# Altium project Stream_Deck.PrjPcb
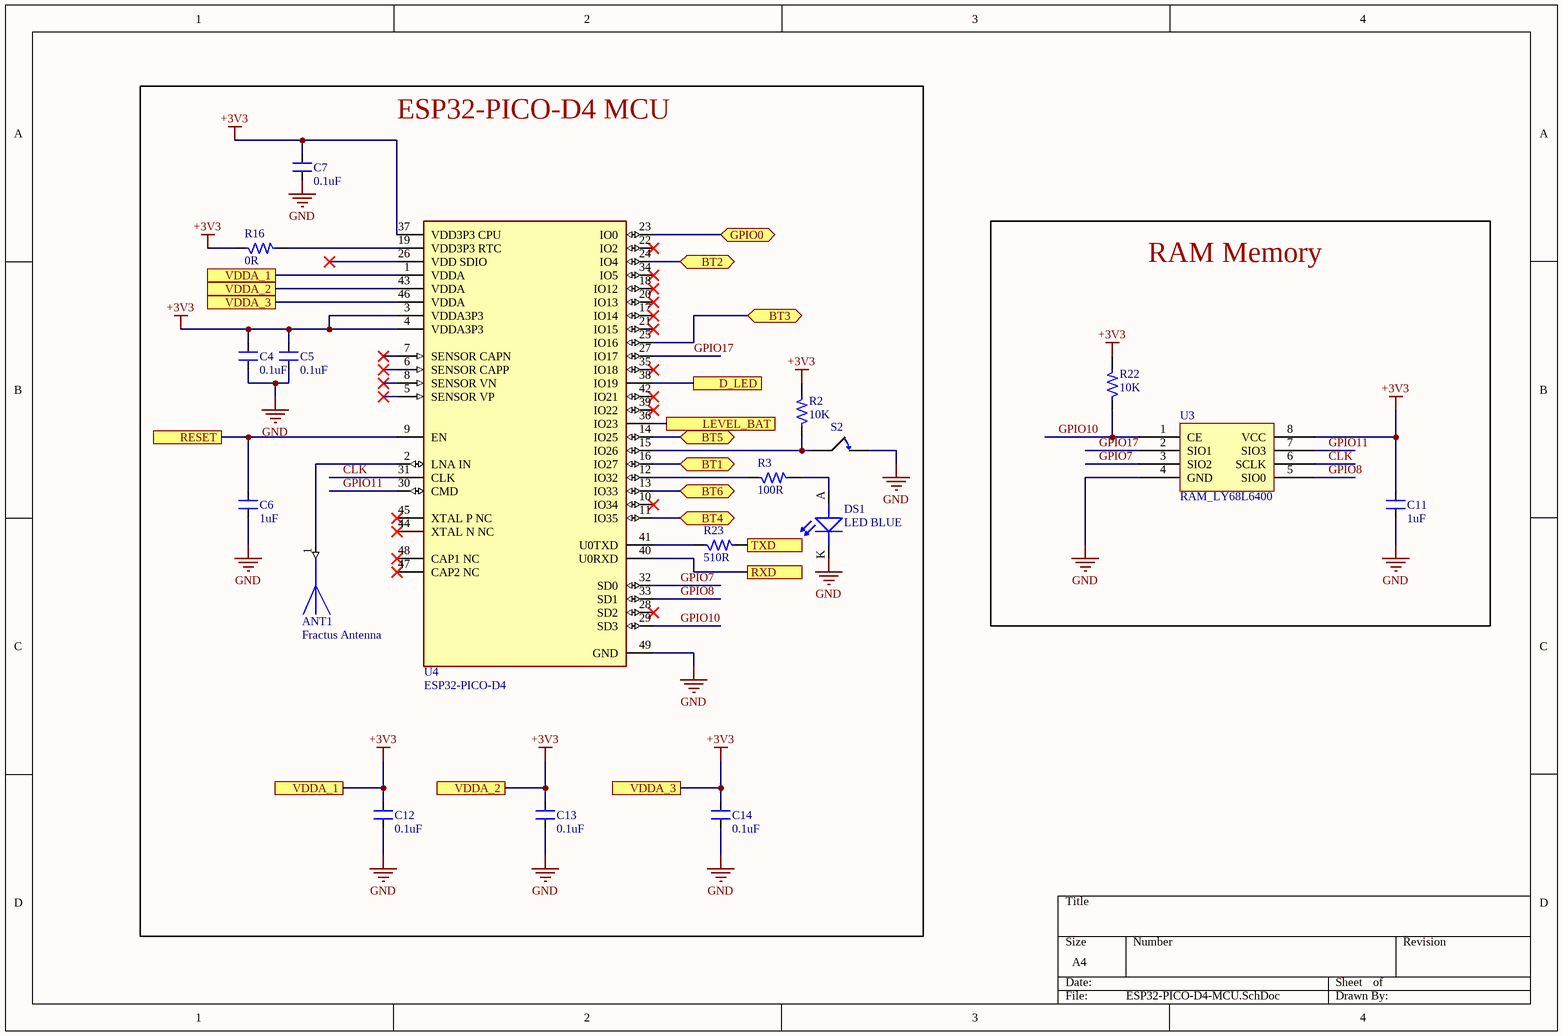
[diagram p0: ESP32-PICO-D4-MCU.SchDoc]
6 sheets, 80 parts. Net scope: flat (ports and power ports of the same name join across sheets).
Board file: main.PcbDoc
Sheets:
  ESP32-PICO-D4-MCU.SchDoc
  POWER-BATTERY.SchDoc
  RESET-SWITCHES.SchDoc
  SERIAL-CHIP.SchDoc
  Block-Diagram.SchDoc
  POWER-BUDGET.SchDoc

## Sheet ESP32-PICO-D4-MCU.SchDoc
size A4; SheetNumber: 1; SheetTotal: 6

### Parts
ANT1  Fractus Antenna  [Fractus_Antenna_NN01-102]
C4  0.1uF  [CAP_0805]
C5  0.1uF  [CAP_0805]
C6  1uF  [CAP_0805]
C7  0.1uF  [CAP_0805]
C11  1uF  [CAP_0805]
C12  0.1uF  [CAP_0805]
C13  0.1uF  [CAP_0805]
C14  0.1uF  [CAP_0805]
DS1  LED BLUE  [LED_0805]
R2  10K  [RES_0805]
R3  100R  [RES_0805]
R16  0R  [RES_0805]
R22  10K  [RES_0805]
R23  510R  [RES_0805]
S2  Button Tactile Switch, NO 0.05 A 0.8mm  [Button8014X17N]  (value not drawn)
U3  RAM_LY68L6400  [RAM_LY68L6400]
U4  ESP32-PICO-D4  [Espressif_Systems_0_IPC_A]

### Blocks framed on the sheet
ESP32-PICO-D4 MCU: ANT1 C4-C7 C12-C14 DS1 R2 R3 R16 R23 S2 U4
RAM Memory: C11 R22 U3

### Ports
BT1 (bidir), BT2 (bidir), BT3 (bidir), BT4 (bidir), BT5 (bidir), BT6 (bidir), D_LED, GPIO0 (bidir), LEVEL_BAT, RESET, RXD, TXD, VDDA_1, VDDA_2, VDDA_3

### Nets
+3V3: C4.2 C5.2 C7.2 C11.2 C12.2 C13.2 C14.2 R2.2 R16.1 R22.2 U3.8(VCC) U4.1(VDDA) U4.3(VDDA3P3) U4.4(VDDA3P3) U4.37(VDD3P3_CPU) U4.43(VDDA) U4.46(VDDA) ; port VDDA_1, port VDDA_2, port VDDA_3
GND: C4.1 C5.1 C6.1 C7.1 C11.1 C12.1 C13.1 C14.1 DS1.K(CATHODE) S2.2 U3.4(GND) U4.49(GND)
BT1: U4.16(IO27) ; port BT1
BT2: U4.24(IO4) ; port BT2
BT3: U4.25(IO16) ; port BT3
BT4: U4.11(IO35) ; port BT4
BT5: U4.14(IO25) ; port BT5
BT6: U4.13(IO33) ; port BT6
CLK: U3.6(SCLK) U4.31(CLK)
D_LED: U4.38(IO19) ; port D_LED
GPIO0: U4.23(IO0) ; port GPIO0
GPIO7: U3.3(SIO2) U4.32(SD0)
GPIO8: U3.5(SIO0) U4.33(SD1)
GPIO10: R22.1 U3.1(CE) U4.29(SD3)
GPIO11: U3.7(SIO3) U4.30(CMD)
GPIO17: U3.2(SIO1) U4.27(IO17)
LEVEL_BAT: U4.36(IO23) ; port LEVEL_BAT
RESET: C6.2 U4.9(EN) ; port RESET
RXD: U4.40(U0RXD) ; port RXD
TXD: R23.2 ; port TXD
NetANT1_1: ANT1.1 U4.2(LNA_IN)
NetDS1_A: DS1.A(ANODE) R3.2
NetR2_1: R2.1 S2.1 U4.15(IO26)
NetR3_1: R3.1 U4.12(IO32)
NetR16_2: R16.2 U4.19(VDD3P3_RTC)
NetR23_1: R23.1 U4.41(U0TXD)

Not connected (* = marked no-connect by the designer): U4 5(SENSOR_VP)* 6(SENSOR_CAPP)* 7(SENSOR_CAPN)* 8(SENSOR_VN)* 10(IO34)* 17(IO14)* 18(IO12)* 20(IO13)* 21(IO15)* 22(IO2)* 26(VDD_SDIO)* 28(SD2)* 34(IO5)* 35(IO18)* 39(IO22)* 42(IO21)* 44(XTAL_N_NC)* 45(XTAL_P_NC)* 47(CAP2_NC)* 48(CAP1_NC)*

### Library data of the parts
ANT1 = ANT_2.45GHz_Bluetooth_WLAN_Zigbee_1.7dBi_NN01-102: 2.45GHz Bluetooth, WLAN, Zigbe Chip RF Antenna 2.4GHz ~ 2.5GHz 1.7dBi Solder Surface Mount
C4 C5 C7 C12-C14 = CAP_0.1uF-50V-10%-0805: 0.1µF ±10% 50V Ceramic Capacitor X7R 0805 (2012 Metric); Manufacturer: Samsung; Manufacturer Part Number: CL21B104KBCNNNC; Alternate Part Number-1: NA; Case/Package: 0805; Supplier-1: SIRICOM; Supplier Part Number-1: 0805B104K500CT
C6 C11 = CAP_1uF-50V-10%-0805_1: 1µF ±10% 50V Ceramic Capacitor X7R 0805 (2012 Metric); Manufacturer: Samsung; Manufacturer Part Number: CL21B104KBCNNNC; Alternate Part Number-1: NA; Case/Package: 0805; Supplier-1: SIRICOM; Supplier Part Number-1: 0805B104K500CT
DS1 = LED_BLUE-3V3-20mA-0805: Blue 470nm LED Indication - Discrete 3.3V 0805 (2012 Metric); Manufacturer: Vishay Lite-On; Manufacturer Part Number: LTST-C171TBKT; Alternate Part Number-1: NA; Case/Package: 0805; Supplier-1: SP ROAD; Supplier Part Number-1: LTST-C171TBKT
R2 R22 = RES_10K-0.125W-1%-0805: 10 kOhms ±1% 0.125W, 1/8W Chip Resistor 0805 (2012 Metric) Automotive AEC-Q200 Thick Film; Manufacturer: CTS; Manufacturer Part Number: WR08X1002FTL; Case/Package: 0805; Supplier-1: SIRICOM; Supplier Part Number-1: WR08X1002FTL; Alternate Part Number-1: WR08X1002FTL
R3 = RES_100R-0.125W-1%-0805: 100 Ohms ±1% 0.125W, 1/8W Chip Resistor 0805 (2012 Metric) Automotive AEC-Q200, Pulse Withstanding Thick Film; Manufacturer: Walsin; Manufacturer Part Number: WR08X1000FTL; Case/Package: 0805; Supplier-1: SIRICOM; Supplier Part Number-1: WR08X1000FTL; Alternate Part Number-1: WR08X1000FTL
R16 = RES_0R-0.125W-1%-0805: 0 Ohms Jumper 0.125W, 1/8W Chip Resistor 0805 (2012 Metric) Automotive AEC-Q200 Thick Film; Manufacturer: Walsin; Manufacturer Part Number: WR08X000PTL; Case/Package: 0805; Supplier-1: SIRICOM; Supplier Part Number-1: WR08X000PTL; Alternate Part Number-1: WR08X000PTL
R23 = RES_510R-0.125W-1%-0805: 510 Ohms ±1% 0.125W, 1/8W Chip Resistor 0805 (2012 Metric) Thin Film; Manufacturer: Yageo; Manufacturer Part Number: RT0805FRE07510RL; Alternate Part Number-1: NA; Case/Package: 0805; Supplier-1: SIRICOM; Supplier Part Number-1: WR08X5100FTL
S2 = Button Tactile Switch, NO 0.05 A 0.8mm: Manufacturer: C & K; Manufacturer Part No.: B3F1000; State: Normaly Open; Date Created: 25 February 2015; Creator: R Kanjee; RS Stock No.: 516-255

## Sheet POWER-BATTERY.SchDoc
size A4; SPICEModelCacheDLZXOQBQ: <root> / <DocumentId>DLZXOQBQ</DocumentId> / <CacheFrame Number="0"> / <Model Name="skydiode" Kind="MDL"> / <Text>*Default Schottky Diode / *Schottky Diode Pinout: A,K / .MODEL SKYDIODE D(EG=0.69 XTI=2)</Text> / </Model> / </CacheFrame> / </root>; SheetNumber: 3; SheetTotal: 7
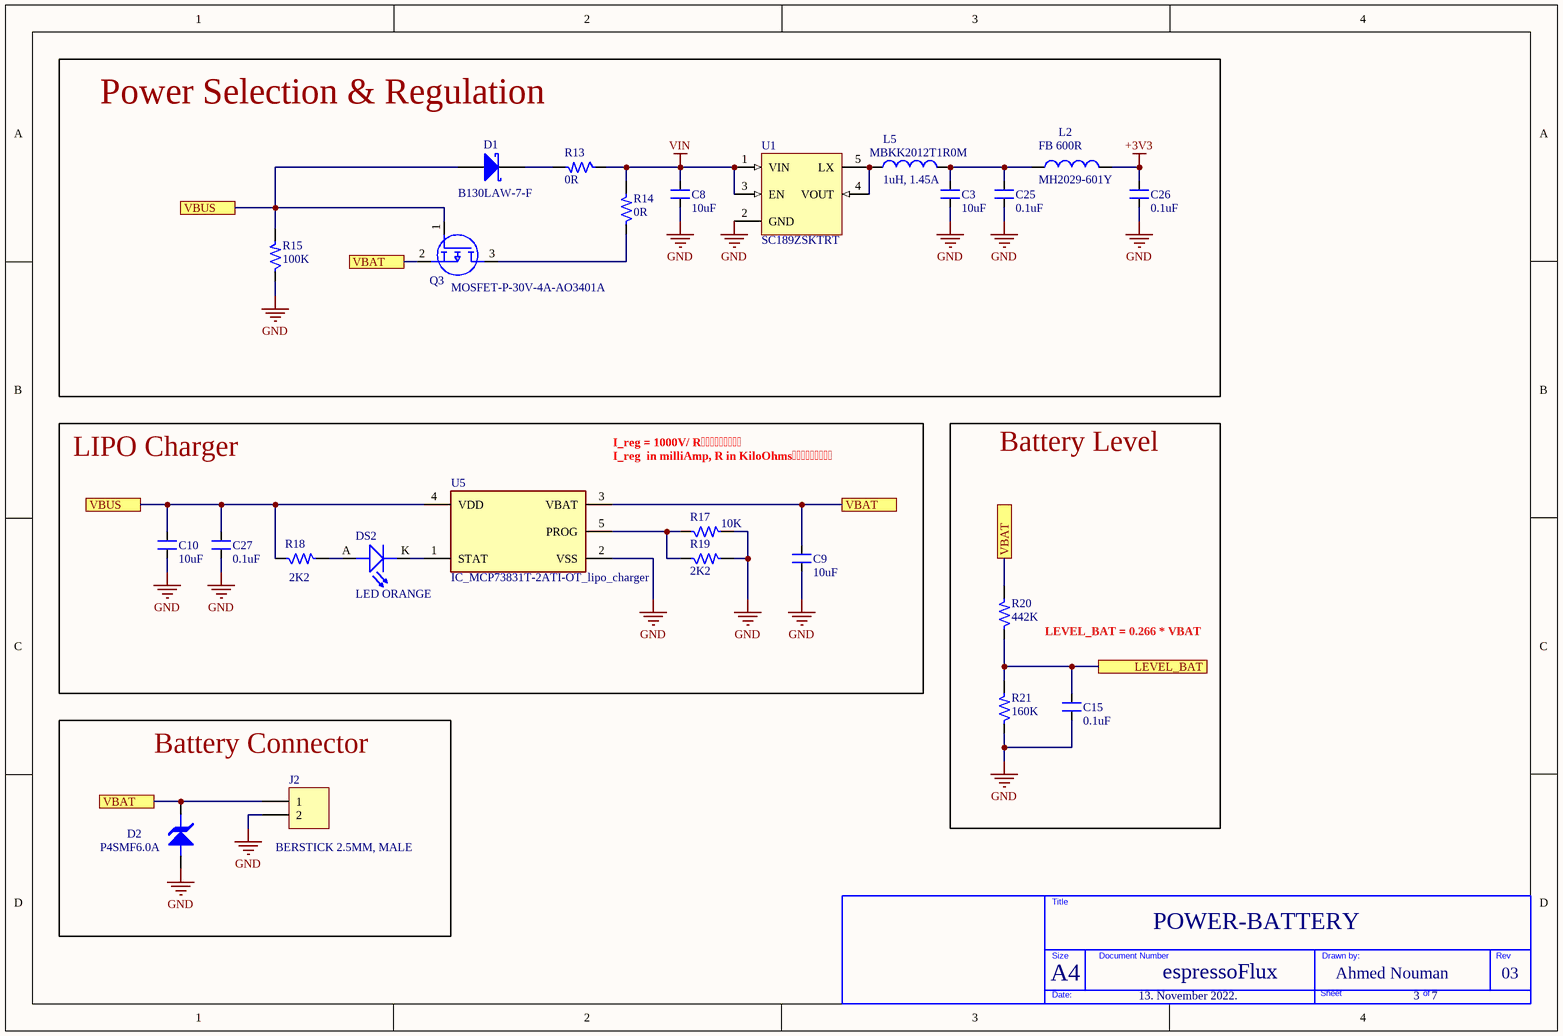
[diagram p1: POWER-BATTERY.SchDoc]

### Parts
(Parts that share a designator on the sheet are numbered #1, #2 ... from top to bottom, then left to right.)
?  (no value)  (graphical)
C3  10uF  [CAP_0805]
C8  10uF  [CAP_0805]
C9  10uF  [CAP_0805]
C10  10uF  [CAP_0805]
C15  0.1uF  [CAP_0805]
C25  0.1uF  [CAP_0805]
C26  0.1uF  [CAP_0805]
C27  0.1uF  [CAP_0805]
D1  B130LAW-7-F  [SOD123 - DOT]
D2#1  P4SMF6.0A  [SOD123FL]
DS2  LED ORANGE  [LED_0805]
J2  BERSTICK 2.5MM, MALE  [CON2_100_43D62_TH_ST]
L2  MH2029-601Y  [INDC2012N]
L5  MBKK2012T1R0M  [INDC2012N]
Q3  MOSFET-P-30V-4A-AO3401A  [P_channelMos_AO3401A]
R13  0R  [RES_0805]
R14  0R  [RES_0805]
R15  100K  [RES_0805]
R17  10K  [RES_0805]
R18  2K2  [RES_0805]
R19  2K2  [RES_0805]
R20  442K  [RES_0805]
R21  160K  [RES_0805]
U1  SC189ZSKTRT  [SOT23-5]
U5  IC_MCP73831T-2ATI-OT_lipo_charger  [SOT23-5]

### Blocks framed on the sheet
Power Selection & Regulation: C3 C8 C25 C26 D1 L2 L5 Q3 R13-R15 U1
LIPO Charger: C9 C10 C27 DS2 R17-R19 U5
Battery Level: C15 R20 R21
Battery Connector: D2#1 J2

### Ports
LEVEL_BAT, VBAT, VBUS

### Nets
+3V3: C26.2 L2.2
GND: C3.1 C8.1 C9.1 C10.1 C15.1 C25.1 C26.1 C27.1 D2#1.1 J2.2 R15.1 R17.2 R19.2 R21.1 U1.2(GND) U5.2(VSS)
VIN: C8.2 R13.1 R14.2 U1.1(VIN) U1.3(EN)
LEVEL_BAT: C15.2 R20.1 R21.2 ; port LEVEL_BAT
VBAT: C9.2 D2#1.2 J2.1 Q3.2(S) R20.2 U5.3(VBAT) ; port VBAT
VBUS: C10.2 C27.2 D1.1(A) Q3.1(G) R15.2 R18.1 U5.4(VDD) ; port VBUS
NetC3_2: C3.2 C25.2 L2.1 L5.2
NetD1_2: D1.2(K) R13.2
NetDS2_A: DS2.A(ANODE) R18.2
NetDS2_K: DS2.K(CATHODE) U5.1(STAT)
NetL5_1: L5.1 U1.4(VOUT) U1.5(LX)
NetQ3_3: Q3.3(D) R14.1
NetR17_1: R17.1 R19.1 U5.5(PROG)

### Notes on the sheet
- (near L2) FB 600R
- 1uH, 1.45A
- I_reg = 1000V/ R
- I_reg  in milliAmp, R in KiloOhms
- LEVEL_BAT = 0.266 * VBAT
- A4
- POWER-BATTERY
- espressoFlux
- Ahmed Nouman
- 03
- 13. November 2022.
- 3    7
- Title
- Size
- Document Number
- Drawn by:
- Rev
- Date:
- Sheet
- of

### Library data of the parts
? = TITLE BLOCK_BLANK
C3 C8 = CAP_1uF-50V-10%-0805_1: as C6 on sheet ESP32-PICO-D4-MCU; Case/Package: 0805; Supplier-1: SIRICOM; Supplier Part Number-1: 0805B104K500CT
C9 C10 = CAP_10uF-50V-10%-0805_1: 10µF ±10% 50V Ceramic Capacitor X7R 0805 (2012 Metric); Manufacturer: Samsung; Manufacturer Part Number: CL21B104KBCNNNC; Alternate Part Number-1: NA; Case/Package: 0805; Supplier-1: SIRICOM; Supplier Part Number-1: 0805B104K500CT
C15 C25-C27 = CAP_0.1uF-50V-20%-0805: 0.1µF ±20% 50V Ceramic Capacitor X7R 0805 (2012 Metric); Manufacturer: Samsung Electro-Mechanics; Manufacturer Part Number: CL21B104MBCNNNC; Alternate Part Number-1: NA; Case/Package: 0805; Supplier-1: SIRICOM; Supplier Part Number-1: 0805B104K500CT
D1 = D Schottky: Schottky Diode; Published: 8-Jun-2000; LatestRevisionDate: 17-Jul-2002; LatestRevisionNote: Re-released for DXP Platform.; PackageReference: SMB; Publisher: Altium Limited; PackageDescription: DO-214-AA/SMB; 2 C-Bend Leads; Body 5.3 x 3.6 mm, inc. leads (LxW); Code_JEDEC: DO-214-AA
D2#1 = TVS-UNIDIRECTIONAL: Value: *
DS2 = LED_ORANGE-2V-20mA-0805: Orange 605nm LED Indication - Discrete 2V 0805 (2012 Metric); Manufacturer: Vishay Lite-On; Manufacturer Part Number: LTST-C170KFKT; Alternate Part Number-1: NA; Case/Package: 0805; Supplier-1: SP ROAD; Supplier Part Number-1: LTST-C170KFKT
J2 = CON-BS-PLG_2X1-100-ST-TH: 2 Pins, 1 Row 2.54mm Pitch, Straight bergstrip, Male; Manufacturer Part Number: NA; Manufacturer: Samtec; Case/Package: TH-CON; Supplier-1: SP ROAD; Supplier Part Number-1: NA; Alternate Part Number-1: NA
L2 = Inductor: Code_IEC: 1005; Value: MPZ1608S601A; Published: 8-Jun-2000; LatestRevisionDate: 17-Jul-2002; LatestRevisionNote: Re-released for DXP Platform.; PackageReference: 0402-A; Publisher: Altium Limited; Code_JEITA: 0402
L5 = Inductor: 1 µH Shielded Drum Core, Wirewound Inductor 1.45 A 106mOhm Max 0805 (2012 Metric); Code_IEC: 1005; Value: MPZ1608S601A; Published: 8-Jun-2000; LatestRevisionDate: 17-Jul-2002; LatestRevisionNote: Re-released for DXP Platform.; PackageReference: 0402-A; Publisher: Altium Limited; Code_JEITA: 0402
Q3 = MOSFET-P-30V-4A-AO3401A: 30V P-Channel MOSFET 4A Rdson = 85 mOhms
R13 R14 = RES_0R-0.125W-1%-0805: as R16 on sheet ESP32-PICO-D4-MCU; Case/Package: 0805; Supplier-1: SIRICOM; Supplier Part Number-1: WR08X000PTL; Alternate Part Number-1: WR08X000PTL
R15 = RES_100K-0.125W-1%-0805: 100 kOhms ±1% 0.125W, 1/8W Chip Resistor 0805 (2012 Metric) Automotive AEC-Q200 Thick Film; Manufacturer: Walsin; Manufacturer Part Number: WR08X1003FTL; Alternate Part Number-1: NA; Case/Package: 0805; Supplier-1: SIRICOM; Supplier Part Number-1: WR08X1003FTL
R17 = RES_10K-0.125W-1%-0805: as R2 on sheet ESP32-PICO-D4-MCU; Case/Package: 0805; Supplier-1: SIRICOM; Supplier Part Number-1: WR08X1002FTL; Alternate Part Number-1: WR08X1002FTL
R18 R19 = RES_2.2K-0.125W-1%-0805: 2.2 kOhms ±1% 0.125W, 1/8W Chip Resistor 0805 (2012 Metric) Thick Film; Manufacturer: Stackpole Electronics; Manufacturer Part Number: CRG0805F2K2; Alternate Part Number-1: CR0805F82201G; Case/Package: 0805; Supplier-1: SIRICOM; Supplier Part Number-1: WR08X2201FTL
R20 = RES_442K-0.125W-1%-0805_1: 442kOhms ±1% 0.125W, 1/8W Chip Resistor 0805 (2012 Metric) Thick Film; Manufacturer: TE Connectivity Passive Product; Manufacturer Part Number: CRG0805F1K5; Alternate Part Number-1: NA; Case/Package: 0805; Supplier-1: SIRICOM; Supplier Part Number-1: NA
R21 = RES_160K-0.125W-1%-0805_1_1: 160kOhms ±1% 0.125W, 1/8W Chip Resistor 0805 (2012 Metric) Thick Film; Manufacturer: TE Connectivity Passive Product; Manufacturer Part Number: CRG0805F1K5; Alternate Part Number-1: NA; Case/Package: 0805; Supplier-1: SIRICOM; Supplier Part Number-1: NA
U1 = SC189ZSKTRT: Buck Switching Regulator IC Positive Fixed 3.3V 1 Output 1.5A SC-74A, SOT-753

## Sheet RESET-SWITCHES.SchDoc
size A4; SheetNumber: 3; SheetTotal: 3
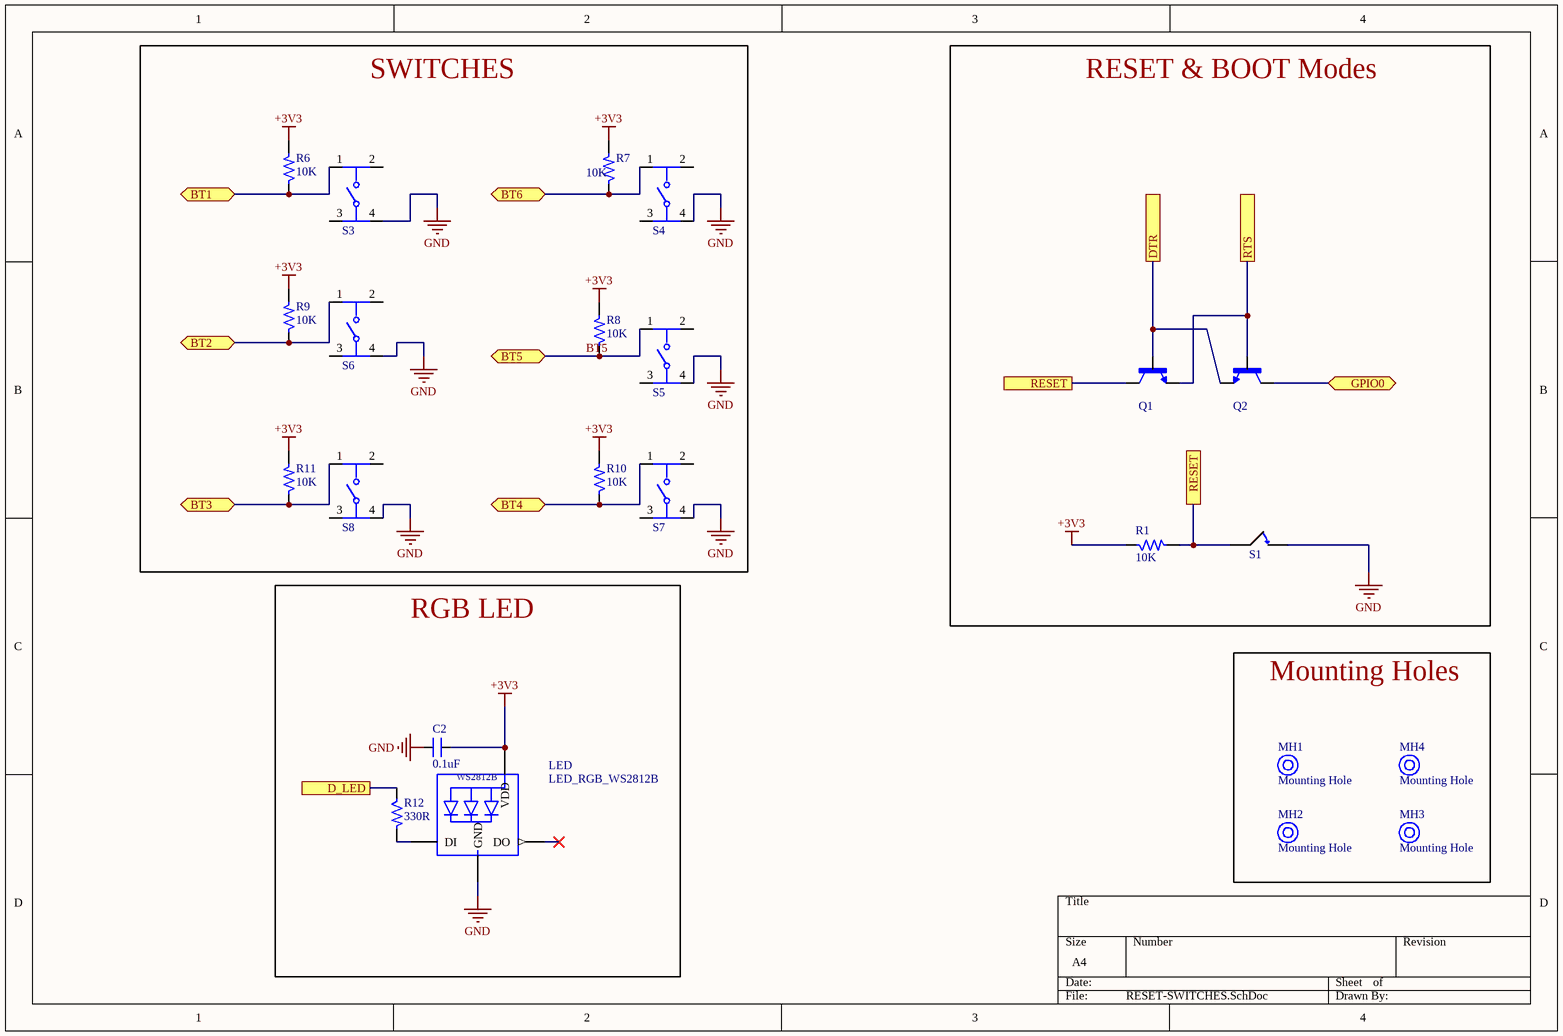
[diagram p2: RESET-SWITCHES.SchDoc]

### Parts
C2  0.1uF  [CAP_0805]
LED  LED_RGB_WS2812B  [WS2812B]
MH1  Mounting Hole  [MOUNTING-NO-COPPER]
MH2  Mounting Hole  [MOUNTING-NO-COPPER]
MH3  Mounting Hole  [MOUNTING-NO-COPPER]
MH4  Mounting Hole  [MOUNTING-NO-COPPER]
Q1  TRANS_NPN_SS8050-G  [TRANS_NPN_SS8050-G]  (value not drawn)
Q2  TRANS_NPN_SS8050-G  [TRANS_NPN_SS8050-G]  (value not drawn)
R1  10K  [RES_0805]
R6  10K  [RES_0805]
R7  10K  [RES_0805]
R8  10K  [RES_0805]
R9  10K  [RES_0805]
R10  10K  [RES_0805]
R11  10K  [RES_0805]
R12  330R  [RES_0805]
S1  Button Tactile Switch, NO 0.05 A 0.8mm  [Button8014X17N]  (value not drawn)
S3  SW_TACTILE_PTS645SM43SMTR92LFS  [C&K_0_MFG - duplicate]  (value not drawn)
S4  SW_TACTILE_PTS645SM43SMTR92LFS  [C&K_0_MFG - duplicate]  (value not drawn)
S5  SW_TACTILE_PTS645SM43SMTR92LFS  [C&K_0_MFG - duplicate]  (value not drawn)
S6  SW_TACTILE_PTS645SM43SMTR92LFS  [C&K_0_MFG - duplicate]  (value not drawn)
S7  SW_TACTILE_PTS645SM43SMTR92LFS  [C&K_0_MFG - duplicate]  (value not drawn)
S8  SW_TACTILE_PTS645SM43SMTR92LFS  [C&K_0_MFG - duplicate]  (value not drawn)

### Blocks framed on the sheet
SWITCHES: R6-R11 S3-S8
RESET & BOOT Modes: Q1 Q2 R1 S1
RGB LED: C2 LED R12
Mounting Holes: MH1-MH4

### Ports
BT1 (bidir), BT2 (bidir), BT3 (bidir), BT4 (bidir), BT5 (bidir), BT6 (bidir), D_LED, DTR, GPIO0 (bidir), RESET, RTS

### Nets
+3V3: C2.2 LED.1-VDD(VDD) R1.1 R6.2 R7.2 R8.2 R9.2 R10.2 R11.2
GND: C2.1 LED.3-GND(GND) S1.2 S3.4 S4.4 S5.4 S6.4 S7.4 S8.4
BT1: R6.1 S3.1 ; port BT1
BT2: R9.1 S6.1 ; port BT2
BT3: R11.1 S8.1 ; port BT3
BT4: R10.1 S7.1 ; port BT4
BT5: R8.1 S5.1 ; port BT5
BT6: R7.1 S4.1 ; port BT6
D_LED: R12.1 ; port D_LED
DTR: Q1.1(B) Q2.2(E) ; port DTR
GPIO0: Q2.3(C) ; port GPIO0
RESET: Q1.3(C) R1.2 S1.1 ; port RESET
RTS: Q1.2(E) Q2.1(B) ; port RTS
NetLED_4-DIN: LED.4-DIN(DI) R12.2

Not connected (* = marked no-connect by the designer): LED 2-DOUT(DO)*; S3 2 3; S4 2 3; S5 2 3; S6 2 3; S7 2 3; S8 2 3

### Library data of the parts
C2 = CAP_0.1uF-50V-10%-0805: as C4 on sheet ESP32-PICO-D4-MCU; Case/Package: 0805; Supplier-1: SIRICOM; Supplier Part Number-1: 0805B104K500CT
LED = LED_RGB_WS2812B: Raspberry Pi HAT _40 pin_ Wheeled Robotics Kit; MF: SparkFun Electronics; Availability: Unavailable; SnapEDA_Link: https://www.snapeda.com/parts/WS2812B/Worldsemi/view-part/1038297/?ref=snap; MP: WS2812B; Price: None; Value: *; Package: None
MH1-MH4 = MH_3H_ONLY_1: Manufacturer Part Number: NA; Case/Package: TH; Manufacturer: NA; Supplier-1: NA; Supplier Part Number-1: NA; Alternate Part Number-1: NA
Q1 Q2 = TRANS_NPN_SS8050-G: Bipolar (BJT) Transistor NPN 25 V 1.5 A 100MHz 300 mW Surface Mount SOT-23-3
R1 R6-R11 = RES_10K-0.125W-1%-0805: as R2 on sheet ESP32-PICO-D4-MCU; Case/Package: 0805; Supplier-1: SIRICOM; Supplier Part Number-1: WR08X1002FTL; Alternate Part Number-1: WR08X1002FTL
R12 = RES_330R-0.125W-1%-0805: 330 Ohms ±1% 0.125W, 1/8W Chip Resistor 0805 (2012 Metric) Automotive AEC-Q200 Thick Film; Manufacturer: Walsin; Manufacturer Part Number: WR08X3300FTL; Alternate Part Number-1: NA; Case/Package: 0805; Supplier-1: SIRICOM; Supplier Part Number-1: WR08X3300FTL
S1 = Button Tactile Switch, NO 0.05 A 0.8mm: as S2 on sheet ESP32-PICO-D4-MCU; Date Created: 25 February 2015; Creator: R Kanjee; RS Stock No.: 516-255

## Sheet SERIAL-CHIP.SchDoc
size A4; SheetNumber: 4; SheetTotal: 6
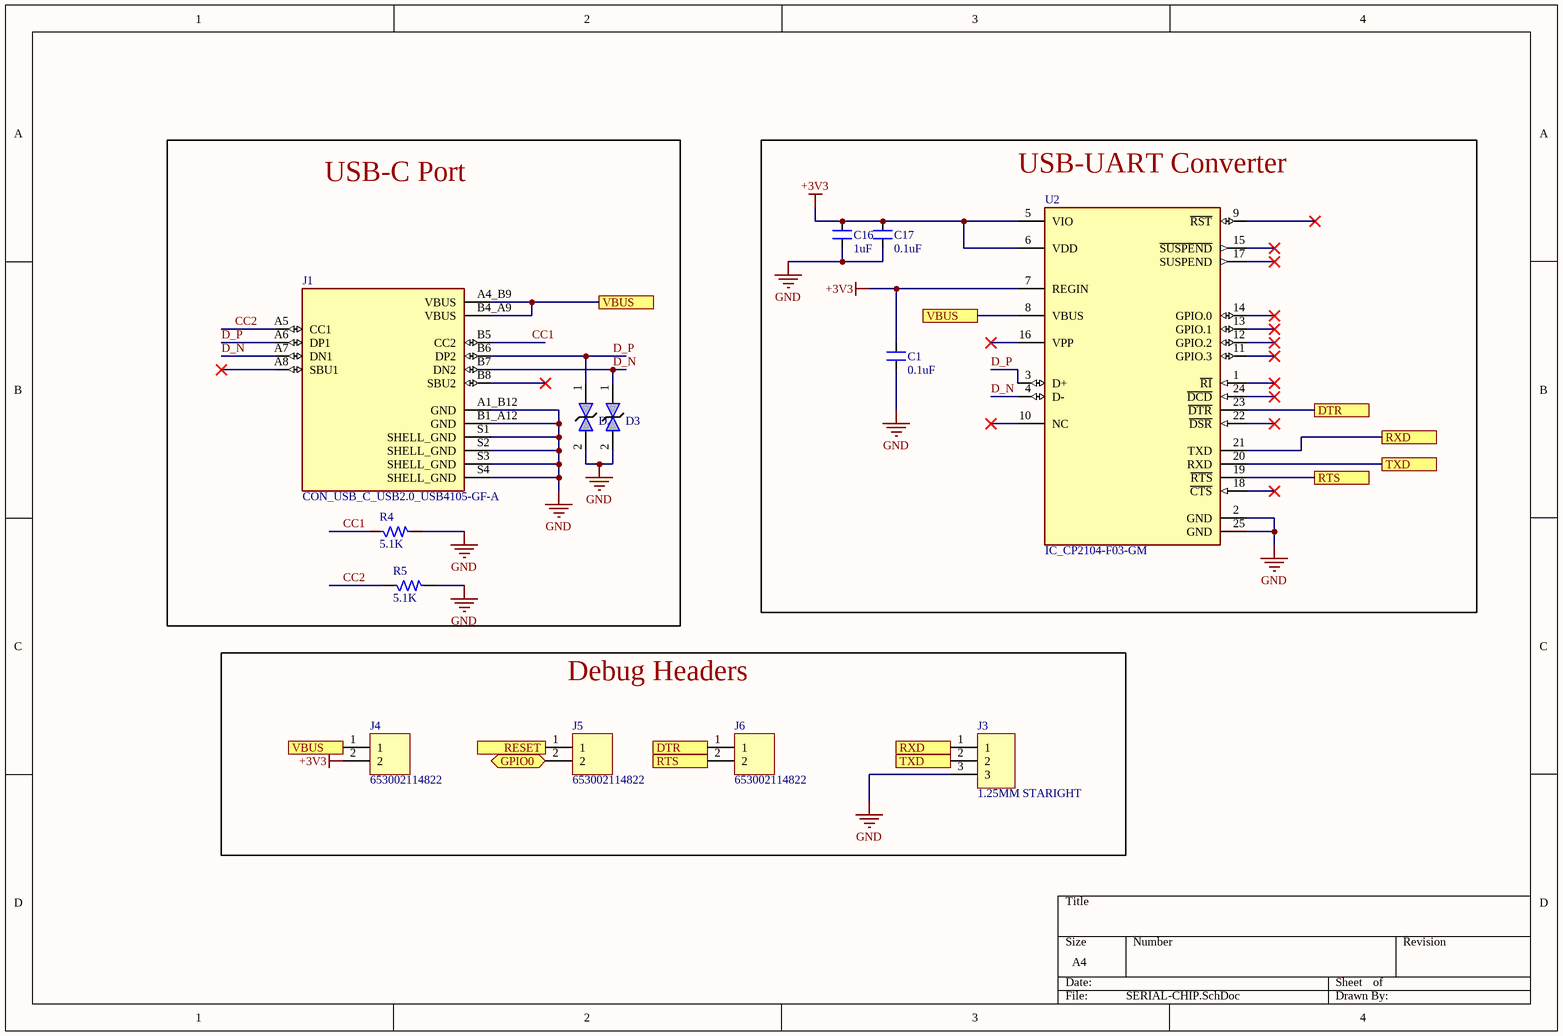
[diagram p3: SERIAL-CHIP.SchDoc]

### Parts
(Parts that share a designator on the sheet are numbered #1, #2 ... from top to bottom, then left to right.)
C1  0.1uF  [CAP_0805]
C16  1uF  [CAP_0805]
C17  0.1uF  [CAP_0805]
D2#2  DIO-TVS-4V-LXES15AAA1-153  [Murata_LXES15_IPC_A]  (value not drawn)
D3  DIO-TVS-4V-LXES15AAA1-153  [Murata_LXES15_IPC_A]  (value not drawn)
J1  CON_USB_C_USB2.0_USB4105-GF-A  [CON_USB_C_USB2.0_USB4105-GF-A]
J3  1.25MM STARIGHT  [CON3_probing_1.25mm]
J4  653002114822  [CON2_probing_1.25mm]
J5  653002114822  [CON2_probing_1.25mm]
J6  653002114822  [CON2_probing_1.25mm]
R4  5.1K  [RES_0805]
R5  5.1K  [RES_0805]
U2  IC_CP2104-F03-GM  [CP2104-F03-GM]

### Blocks framed on the sheet
USB-C Port: D2#2 D3 J1 R4 R5
USB-UART Converter: C1 C16 C17 U2
Debug Headers: J3-J6

### Ports
DTR, GPIO0 (bidir), RESET, RTS, RXD, TXD, VBUS

### Nets
+3V3: C1.2 C16.2 C17.2 J4.2 U2.5(VIO) U2.6(VDD) U2.7(REGIN)
GND: C1.1 C16.1 C17.1 D2#2.2 D3.2 J1.A1_B12(GND) J1.B1_A12(GND) J1.S1(SHELL_GND) J1.S2(SHELL_GND) J1.S3(SHELL_GND) J1.S4(SHELL_GND) J3.3 R4.2 R5.2 U2.2(GND) U2.25(GND)
CC1: J1.B5(CC2) R4.1
CC2: J1.A5(CC1) R5.1
D_N: D3.1 J1.A7(DN1) J1.B7(DN2) U2.4(D-)
D_P: D2#2.1 J1.A6(DP1) J1.B6(DP2) U2.3(D+)
DTR: J6.1 U2.23(~{DTR}) ; port DTR
GPIO0: J5.2 ; port GPIO0
RESET: J5.1 ; port RESET
RTS: J6.2 U2.19(~{RTS}) ; port RTS
RXD: J3.1 U2.21(TXD) ; port RXD
TXD: J3.2 U2.20(RXD) ; port TXD
VBUS: J1.A4_B9(VBUS) J1.B4_A9(VBUS) J4.1 U2.8(VBUS) ; port VBUS

Not connected (* = marked no-connect by the designer): J1 A8(SBU1)* B8(SBU2)*; U2 1(~{RI})* 9(~{RST})* 10(NC)* 11(GPIO.3)* 12(GPIO.2)* 13(GPIO.1)* 14(GPIO.0)* 15(~{SUSPEND})* 16(VPP)* 17(SUSPEND)* 18(~{CTS})* 22(~{DSR})* 24(~{DCD})*

### Library data of the parts
C1 C17 = CAP_0.1uF-50V-10%-0805: as C4 on sheet ESP32-PICO-D4-MCU; Case/Package: 0805; Supplier-1: SIRICOM; Supplier Part Number-1: 0805B104K500CT
C16 = CAP_1uF-50V-10%-0805_1: as C6 on sheet ESP32-PICO-D4-MCU; Case/Package: 0805; Supplier-1: SIRICOM; Supplier Part Number-1: 0805B104K500CT
D2#2 D3 = DIO-TVS-4V-LXES15AAA1-153: ESD Suppressor Diode TVS Bi-Dir 4V 2-Pin Case 0402(1005Metric) T/R
J3 = CON-3-1.25MM-PROBING: 3 Pins, 1 Row 1.25mm Pitch, straight Connector, male; Manufacturer Part Number: 653003114822; Manufacturer: WURTH; Mating Part Number: 653003113322; Crimp Part Number: 653153128130; Alternate Part Number-1: NA; Case/Package: TH-CON; Supplier-1: WURTH; Supplier Part Number-1: 653003114822
J4-J6 = CON-2-1.25MM-PROPING: 2 Pins, 1 Row 1.25mm Pitch, Straight Connector, male; Manufacturer: JST; Mating Part Number: 653002113322; Crimp Part Number: 653153128130; Alternate Part Number-1: NA; Manufacturer Part Number: 653002114822; Case/Package: TH-CON; Supplier-1: WURTH; Supplier Part Number-1: 653002114822
R4 R5 = RES_5.1K-0.125W-1%-0805: 5.1 kOhms ±1% 0.125W, 1/8W Chip Resistor 0805 (2012 Metric) Moisture Resistant Thick Film; Manufacturer: Stackpole Electronics; Manufacturer Part Number: RC0805FR-075K9L; Alternate Part Number-1: NA; Case/Package: 0805; Supplier-1: SIRICOM; Supplier Part Number-1: WR08X5901FTL

## Sheet Block-Diagram.SchDoc
size A4; SheetNumber: 5; SheetTotal: 5
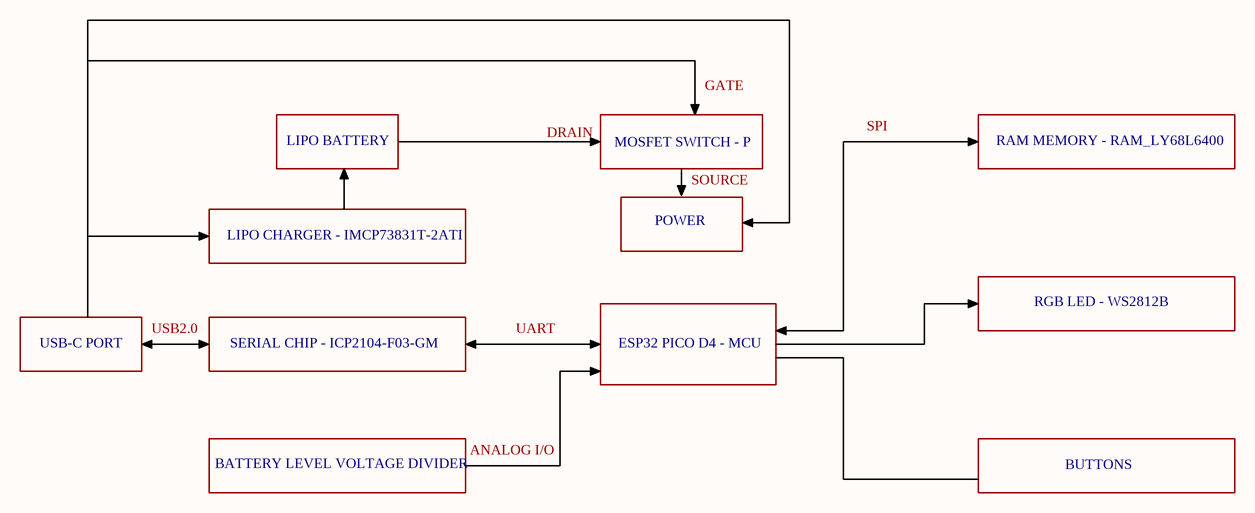
[diagram p4: Block-Diagram.SchDoc]

### Notes on the sheet
- GATE
- LIPO BATTERY
- DRAIN
- MOSFET SWITCH - P
- SPI
- RAM MEMORY - RAM_LY68L6400
- POWER
- SOURCE
- LIPO CHARGER - IMCP73831T-2ATI
- RGB LED - WS2812B
- USB-C PORT
- USB2.0
- SERIAL CHIP - ICP2104-F03-GM
- UART
- ESP32 PICO D4 - MCU
- BATTERY LEVEL VOLTAGE DIVIDER
- ANALOG I/O
- BUTTONS

## Sheet POWER-BUDGET.SchDoc
size A4; SheetNumber: 6; SheetTotal: 6
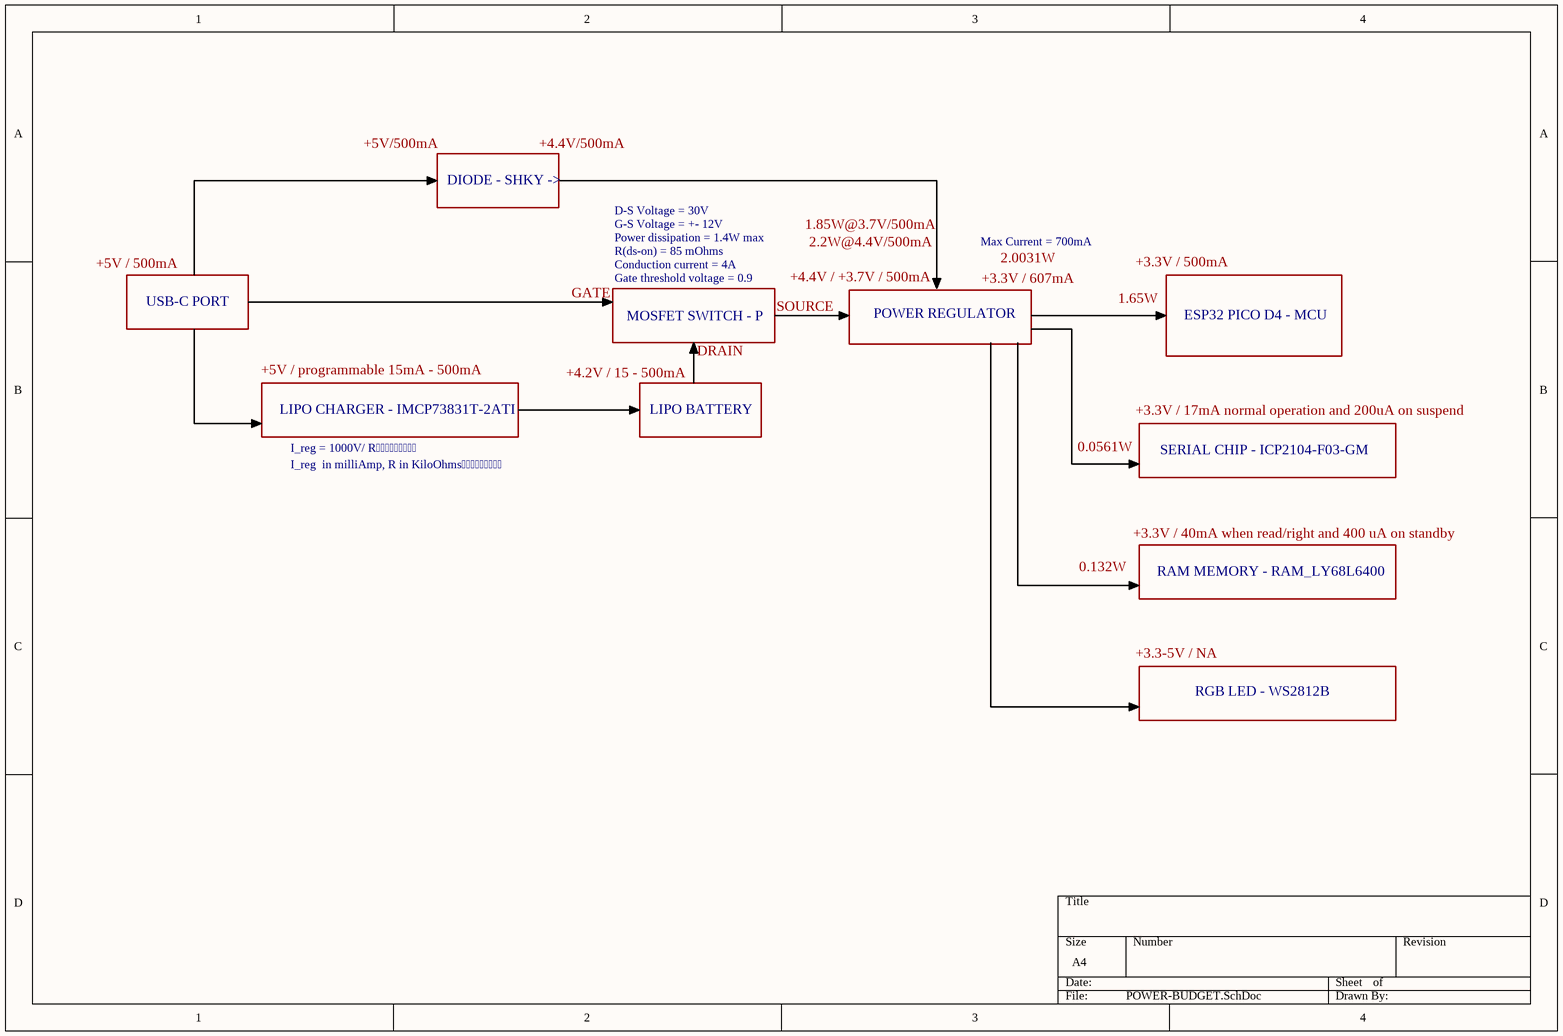
[diagram p5: POWER-BUDGET.SchDoc]

### Notes on the sheet
- +5V/500mA
- +4.4V/500mA
- DIODE - SHKY ->
- Power dissipation = 1.4W max
- G-S Voltage = +- 12V
- D-S Voltage = 30V
- 1.85W@3.7V/500mA
- 2.2W@4.4V/500mA
- Max Current = 700mA
- +5V / 500mA
- USB-C PORT
- GATE
- Gate threshold voltage = 0.9
- Conduction current = 4A
- R(ds-on) = 85 mOhms
- SOURCE
- +4.4V / +3.7V / 500mA
- +3.3V / 607mA
- 2.0031W
- 1.65W
- +3.3V / 500mA
- +5V / programmable 15mA - 500mA
- +4.2V / 15 - 500mA
- MOSFET SWITCH - P
- DRAIN
- POWER REGULATOR
- ESP32 PICO D4 - MCU
- LIPO CHARGER - IMCP73831T-2ATI
- I_reg = 1000V/ R
- LIPO BATTERY
- 0.0561W
- +3.3V / 17mA normal operation and 200uA on suspend
- I_reg  in milliAmp, R in KiloOhms
- SERIAL CHIP - ICP2104-F03-GM
- 0.132W
- +3.3V / 40mA when read/right and 400 uA on standby
- RAM MEMORY - RAM_LY68L6400
- +3.3-5V / NA
- RGB LED - WS2812B

## Nets that join several sheets
+3V3: ESP32-PICO-D4-MCU (17 pins), POWER-BATTERY (C26.2 L2.2), RESET-SWITCHES (9 pins), SERIAL-CHIP (7 pins)
GND: ESP32-PICO-D4-MCU (12 pins), POWER-BATTERY (16 pins), RESET-SWITCHES (9 pins), SERIAL-CHIP (16 pins)
BT1: ESP32-PICO-D4-MCU (U4.16), RESET-SWITCHES (R6.1 S3.1)
BT2: ESP32-PICO-D4-MCU (U4.24), RESET-SWITCHES (R9.1 S6.1)
BT3: ESP32-PICO-D4-MCU (U4.25), RESET-SWITCHES (R11.1 S8.1)
BT4: ESP32-PICO-D4-MCU (U4.11), RESET-SWITCHES (R10.1 S7.1)
BT5: ESP32-PICO-D4-MCU (U4.14), RESET-SWITCHES (R8.1 S5.1)
BT6: ESP32-PICO-D4-MCU (U4.13), RESET-SWITCHES (R7.1 S4.1)
D_LED: ESP32-PICO-D4-MCU (U4.38), RESET-SWITCHES (R12.1)
DTR: RESET-SWITCHES (Q1.1 Q2.2), SERIAL-CHIP (J6.1 U2.23)
GPIO0: ESP32-PICO-D4-MCU (U4.23), RESET-SWITCHES (Q2.3), SERIAL-CHIP (J5.2)
LEVEL_BAT: ESP32-PICO-D4-MCU (U4.36), POWER-BATTERY (C15.2 R20.1 R21.2)
RESET: ESP32-PICO-D4-MCU (C6.2 U4.9), RESET-SWITCHES (Q1.3 R1.2 S1.1), SERIAL-CHIP (J5.1)
RTS: RESET-SWITCHES (Q1.2 Q2.1), SERIAL-CHIP (J6.2 U2.19)
RXD: ESP32-PICO-D4-MCU (U4.40), SERIAL-CHIP (J3.1 U2.21)
TXD: ESP32-PICO-D4-MCU (R23.2), SERIAL-CHIP (J3.2 U2.20)
VBUS: POWER-BATTERY (7 pins), SERIAL-CHIP (J1.A4_B9 J1.B4_A9 J4.1 U2.8)